# Altium project CBCM PCB rev1.PrjPCB
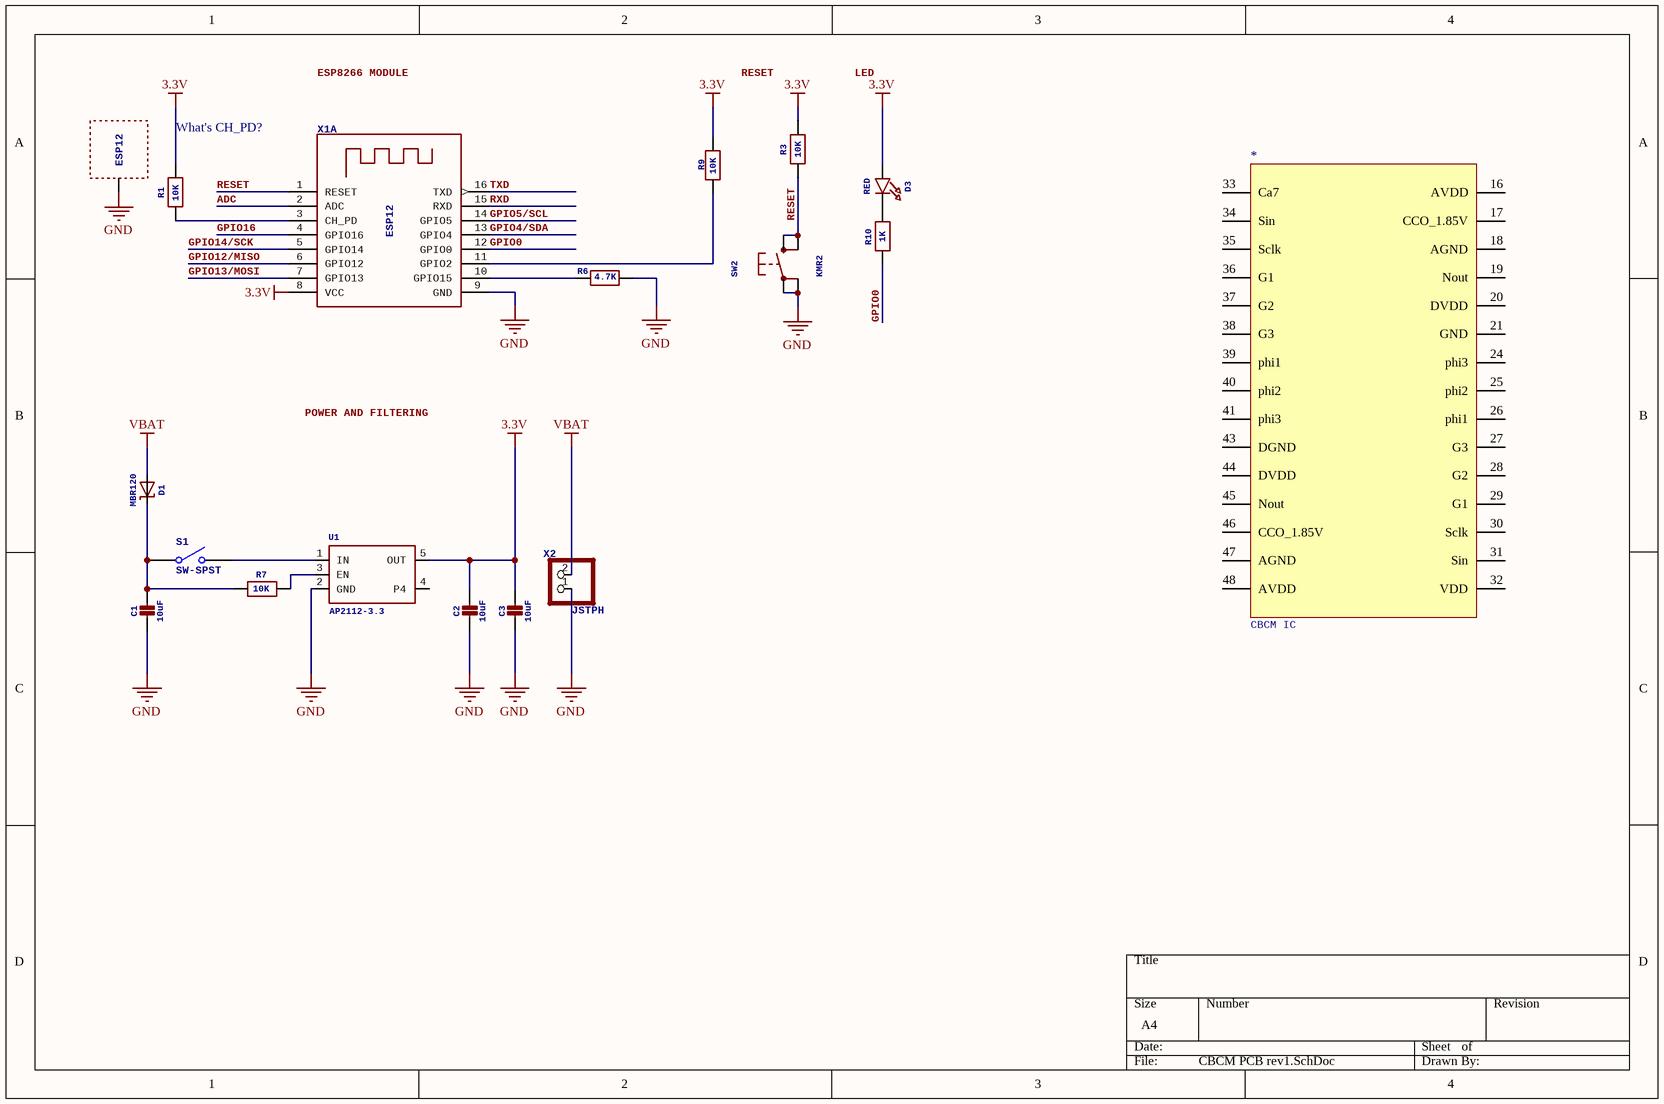
[diagram p0: CBCM PCB rev1.SchDoc]
1 sheet, 18 parts. Net scope: global (net labels, ports and power ports of the same name join across sheets).

## Sheet CBCM PCB rev1.SchDoc
size A4

### Parts
*  CBCM IC  [PGA85x11]
C1  10uF  [0603-NO]
C2  10uF  [0603-NO]
C3  10uF  [0603-NO]
D1  MBR120  [SOD-123]
D3  RED  [CHIPLED_0805_NOOUTLINE]
R1  10K  [0603-NO]
R3  10K  [0603-NO]
R6  4.7K  [0603-NO]
R7  10K  [0603-NO]
R9  10K  [0603-NO]
R10  1K  [0603-NO]
S1  SW-SPST  [SPST-2]
SW2  KMR2  [BTN_KMR2_4.6X2.8]
U1  AP2112-3.3  [SOT23-5]
X1  ESP-12  [ESP-12S]  (value not drawn)  (part A of 2)
X2  JSTPH  [JSTPH2]
X?  ESP-12  [ESP-12S]  (value not drawn)  (part B of 2)

### Nets
3.3V: C2.1 C3.1 D3.A R1.2 R3.2 R9.2 U1.5(OUT) X1.8(VCC)
GND: C1.2 C2.2 C3.2 R6.1 SW2.A(P) SW2.A'(P1) U1.2(GND) X1.9(GND) X2.1 X?.P$1(TP)
VBAT: D1.A X2.2
ADC: X1.2(ADC)
GPIO0: R10.1 X1.12(GPIO0)
GPIO4/SDA: X1.13(GPIO4)
GPIO5/SCL: X1.14(GPIO5)
GPIO12/MISO: X1.6(GPIO12)
GPIO13/MOSI: X1.7(GPIO13)
GPIO14/SCK: X1.5(GPIO14)
GPIO16: X1.4(GPIO16)
RESET: R3.1 SW2.B(S) SW2.B'(S1) X1.1(RESET)
RXD: X1.15(RXD)
TXD: X1.16(TXD)
NetC1_1: C1.1 D1.C R7.1 S1.1(COMMON)
NetD3_C: D3.C R10.2
NetR1_1: R1.1 X1.3(CH_PD)
NetR6_2: R6.2 X1.10(GPIO15)
NetR7_2: R7.2 U1.3(EN)
NetR9_1: R9.1 X1.11(GPIO2)
NetS1_2: S1.2(NO) U1.1(IN)

Not connected (* = marked no-connect by the designer): * 16(AVDD) 17(CCO_1.85V) 18(AGND) 19(Nout) 20(DVDD) 21(GND) 24(phi3) 25(phi2) 26(phi1) 27(G3) 28(G2) 29(G1) 30(Sclk) 31(Sin) 32(VDD) 33(Ca7) 34(Sin) 35(Sclk) 36(G1) 37(G2) 38(G3) 39(phi1) 40(phi2) 41(phi3) 43(DGND) 44(DVDD) 45(Nout) 46(CCO_1.85V) 47(AGND) 48(AVDD); U1 4(P4)

### Notes on the sheet
- ESP8266 MODULE
- RESET
- LED
- (near R1) What's CH_PD?
- POWER AND FILTERING

### Library data of the parts
* = CBCM IC: pin to pad: 16>H1 17>H2 18>J1 19>K1 20>J2 21>L1 24>L2 25>L3 26>K4 27>L4 28>J5 29>K5 30>L5 31>K6 32>J6 33>J7 34>L7 35>K7 36>L6 37>L8 38>K8 39>L9 40>L10 41>K9 43>K10 44>J10 45>K11 46>J11 47>H10 48>H11
C1-C3 = CAP_CERAMIC0603_NO: Ceramic CapacitorsFor new designs, use the packages preceded by an '_' character since they are more reliable:The following footprints should be used on most boards:For extremely tight-pitch boards where space is at a premium, the following 'micro-pitch' footprints can be used (smaller pads, no silkscreen outline, etc.):; GateName_1: G$1; SymbolName_1: CAPACITOR; DeviceName: 0603_NO; LibraryName: microbuilder; DeviceSetName: CAP_CERAMIC
D1 = DIODE-SCHOTTKYSOD-123: GateName_1: G$1; SymbolName_1: DIODE-SCHOTTKY; DeviceName: SOD-123; LibraryName: microbuilder; DeviceSetName: DIODE-SCHOTTKY
D3 = LED0805_NOOUTLINE: LED0603 - 0603 Surface Mount Package 2mA:5mA:0805 - 0805 Surface Mount Package 2mA:20mA:; GateName_1: G$1; SymbolName_1: LED; DeviceName: 0805_NOOUTLINE; LibraryName: microbuilder; DeviceSetName: LED
R1 R3 R6 R7 R9 R10 = RESISTOR_0603_NOOUT: ResistorsFor new designs, use the packages preceded by an '_' character since they are more reliable:The following footprints should be used on most boards:For extremely tight-pitch boards where space is at a premium, the following 'micro-pitch' footprints can be used (smaller pads, no silkscreen outline, etc.):; GateName_1: G$1; SymbolName_1: RESISTOR; DeviceName: _0603_NOOUT; LibraryName: microbuilder; DeviceSetName: RESISTOR
S1 = SW-SPST: Single-Pole, Single-Throw Switch; Published: 24-Mar-1999; LatestRevisionDate: 17-Jul-2002; LatestRevisionNote: Re-released for DXP Platform.; PackageReference: SPST-2; Publisher: Altium Limited; PackageDescription: Switch; 2 Leads
SW2 = SWITCH_TACT_SMT4.6X2.8: SMT Tact Switches; GateName_1: G$1; SymbolName_1: BUTTON_4PIN; DeviceName: 4.6X2.8; LibraryName: microbuilder; DeviceSetName: SWITCH_TACT_SMT
U1 = VREG_SOT23-5: SOT23-5 Fixed Voltage RegulatorsPartCurrent OutV OutV InV Dropout胃JA (掳C/W)TJ (掳C)Digikey Part No.  ADP121  150mA  3.3V  3.4-5.5V  0.09V @ 150mA  --  --  ADP121-AUJZ33R7CT-ND  ADP121  150mA  3.0V  3.1-5.5V  0.09V @ 150mA  --  --  ADP121-AUJZ30R7CT-ND  ADP122     300mA  3.3V  3.4-5.5V  0.085V @ 300mA  --  --  ADP122AUJZ-3.3-R7CT-ND  ADP1712     300mA  3.3V  3.5-5.5V  0.17V @ 300mA  --  --  ADP1712AUJZ-3.3-R7TR-ND  AP7311 (Low Cost)  150mA  3.3V  3.5-6V  0.15V @ 150mA  --  --  AP7311-33WG-7DICT-ND  LD39015M18R  150mA  1.8V  1.9V-5.5V  0.08V @ 100mA  --  --  497-6977-1-ND  LP2985A-33DBVR  150mA  3.3V  3.3-16V  0.28V @ 150mA  206  150  296-18479-1-ND  MCP1824T-3302E/OT  300mA  3.3V  3.5V-6V  0.2V @ 300mA  --  --  MCP1824T-3302E/OTCT-ND  MIC5205-2.5YM5 TR  150mA  2.5V  2.7-16V  0.165V @ 150mA  --  --  576-1257-2-ND  MIC5205-3.0YM5 TR  150mA  3.0V  3.2V-16V  0.165V @ 150mA  --  --  576-1258-2-ND  MIC5205-3.3YM5 TR  150mA  3.3V  3.5V-16V  0.165V @ 150mA  --  --  576-1259-2-ND  TPS780330220  150mA  3.3V+2.2V  3.6-5.5V  250mV Max  --  --  296-23332-1-ND  TDA3663/N1,135  100mA  3.3V  3.5-45V  0.18V @ 50mA  --  --  568-5343-1-ND                                Max operating temp can be calculated using 胃JA, TJ (max junction temperature), and power in watts.  Set the "Maximum Ambient Temperature" until it reaches TJ ("Max Junction Temperature"), which is the absolute limit for safe use of the regulator: Heat Sink Temperature CalculatorFor example, With 12V source into a 3.3V LP2985 and a 30mA load, we are dissipating (12V-3.3V) * 0.03A = 0.261W.  With a 胃JA of 206 掳C/W, a TJ of 150掳C, and 261mW we can safely use the chip without a heat sink up to 75掳C (=147.1掳C Junction Temperature).; GateName_1: G$1; SymbolName_1: VREG_SOT23-5; LibraryName: microbuilder; DeviceSetName: VREG_SOT23-5
X1 X? = ESP-12S: GateName_1: G$1; SymbolName_1: ESP8266-12; GateName_2: G$2; SymbolName_2: THERMAL-SLUG; LibraryName: microbuilder; DeviceSetName: ESP-12S; ESP12: ESP12
X2 = CON_JST_PH_2PIN: JST 2-Pin Right-Angle Connector; GateName_1: G$1; SymbolName_1: PINHD2; LibraryName: microbuilder; DeviceSetName: CON_JST_PH_2PIN